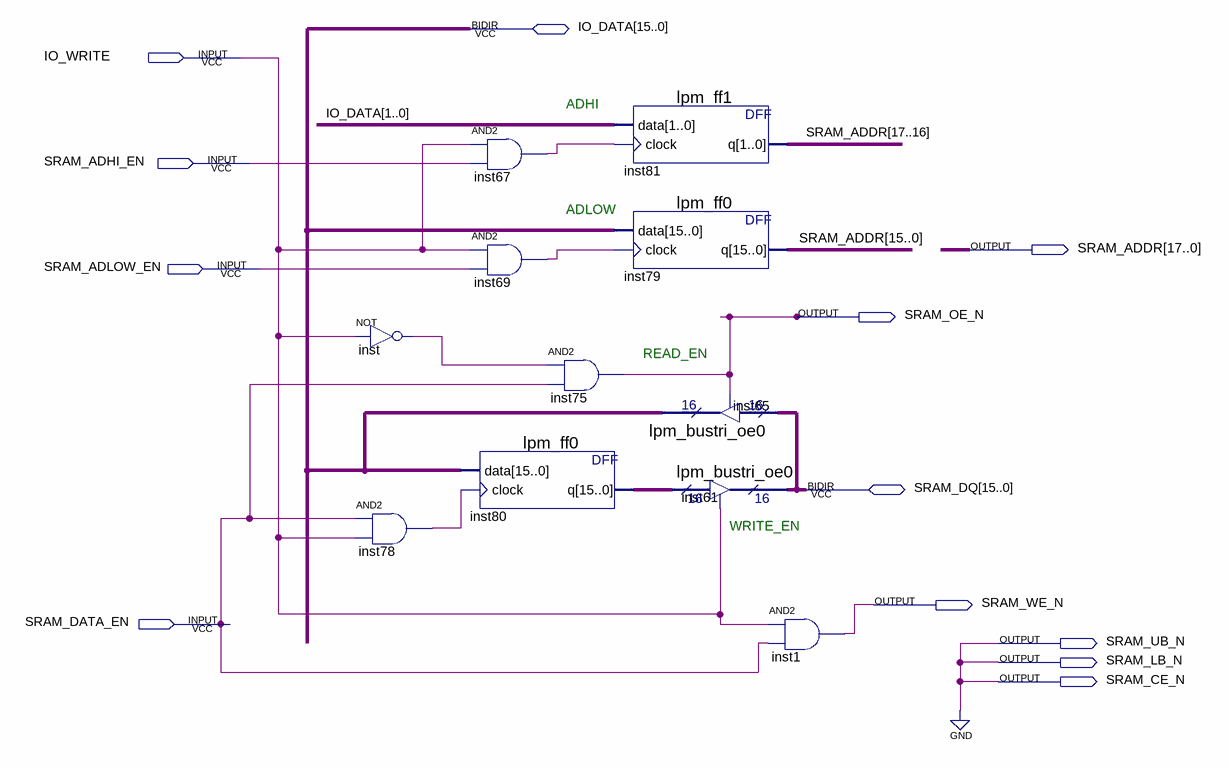
[diagram p0: schematic sheet]
// Quartus schematic FASTER_SRAM.bdf as structural Verilog: 11 symbols, 12 pins
module FASTER_SRAM (
  input  IO_WRITE,
  input  SRAM_ADHI_EN,
  input  SRAM_ADLOW_EN,
  input  SRAM_DATA_EN,
  inout  [15:0] IO_DATA,
  inout  [15:0] SRAM_DQ,
  output [17:0] SRAM_ADDR,
  output SRAM_OE_N,
  output SRAM_WE_N,
  output SRAM_UB_N,
  output SRAM_LB_N,
  output SRAM_CE_N
);

  wire inst67_out, inst69_out, inst78_out, inst_out;
  wire [15:0] inst80_q;

  not inst (inst_out, IO_WRITE);
  and inst78 (inst78_out, SRAM_DATA_EN, IO_WRITE);
  and inst67 (inst67_out, IO_WRITE, SRAM_ADHI_EN);
  and inst69 (inst69_out, IO_WRITE, SRAM_ADLOW_EN);
  lpm_ff0 inst80 (.data(IO_DATA), .clock(inst78_out), .q(inst80_q));
  and inst75 (SRAM_OE_N, inst_out, SRAM_DATA_EN);
  lpm_ff1 inst81 (.data(IO_DATA[1:0]), .clock(inst67_out), .q(SRAM_ADDR[17:16]));
  lpm_ff0 inst79 (.data(IO_DATA), .clock(inst69_out), .q(SRAM_ADDR[15:0]));
  lpm_bustri_oe0 inst65 (.enabledt(SRAM_OE_N), .data(SRAM_DQ), .tridata(IO_DATA));
  lpm_bustri_oe0 inst61 (.enabledt(IO_WRITE), .data(inst80_q), .tridata(SRAM_DQ));
  and inst1 (SRAM_WE_N, IO_WRITE, SRAM_DATA_EN);

  assign SRAM_CE_N = 1'b0;
  assign SRAM_LB_N = 1'b0;
  assign SRAM_UB_N = 1'b0;

  // Notes on the sheet:
  //   ADHI
  //   ADLOW
  //   READ_EN
  //   WRITE_EN
endmodule
